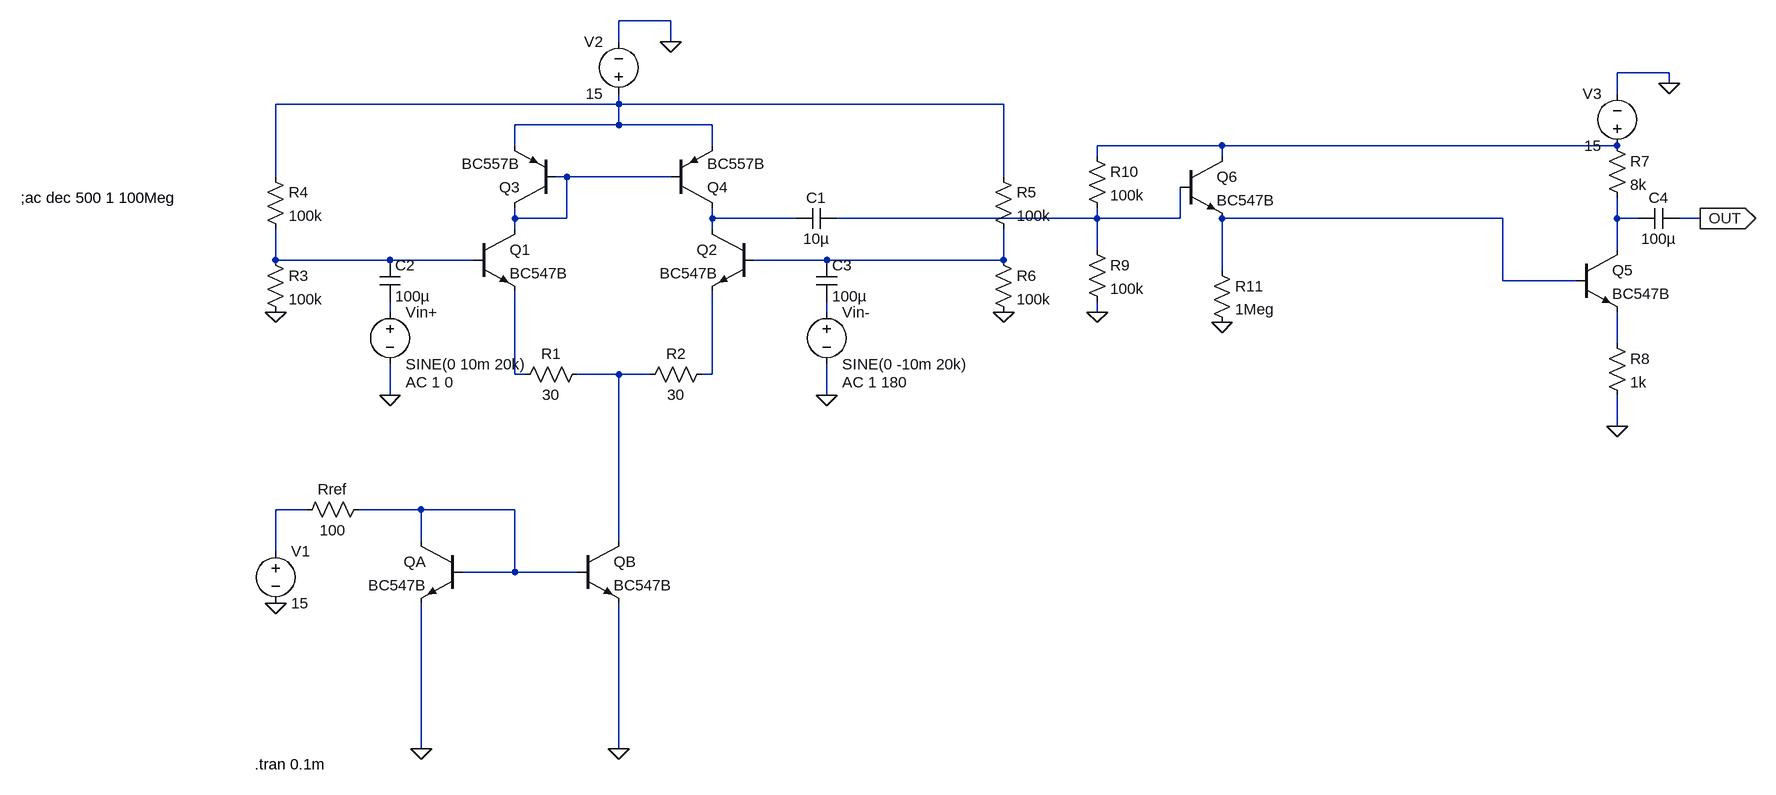
[diagram p0: schematic BJT_Diff_amp_Gain_DE_Buffer.asc]
BJT_Diff_amp_Gain_DE_Buffer.asc, the LTspice schematic file:
Version 4
SHEET 1 2092 1044
WIRE 240 -240 160 -240
WIRE 160 -208 160 -240
WIRE 240 -208 240 -240
WIRE 1776 -160 1696 -160
WIRE 1776 -144 1776 -160
WIRE 1696 -128 1696 -160
WIRE 160 -112 160 -128
WIRE 160 -112 -368 -112
WIRE 752 -112 160 -112
WIRE 160 -80 160 -112
WIRE 160 -80 0 -80
WIRE 304 -80 160 -80
WIRE 0 -48 0 -80
WIRE 304 -48 304 -80
WIRE 1088 -48 896 -48
WIRE 1696 -48 1088 -48
WIRE 896 -32 896 -48
WIRE 1088 -32 1088 -48
WIRE -368 0 -368 -112
WIRE 80 0 64 0
WIRE 240 0 80 0
WIRE 752 0 752 -112
WIRE 0 64 0 48
WIRE 80 64 80 0
WIRE 80 64 0 64
WIRE 304 64 304 48
WIRE 432 64 304 64
WIRE 896 64 896 48
WIRE 896 64 496 64
WIRE 1024 64 1024 16
WIRE 1024 64 896 64
WIRE 1520 64 1088 64
WIRE 1696 64 1696 32
WIRE 1728 64 1696 64
WIRE 1824 64 1792 64
WIRE 0 80 0 64
WIRE 304 80 304 64
WIRE 896 112 896 64
WIRE 1696 112 1696 64
WIRE -368 128 -368 80
WIRE -192 128 -368 128
WIRE -64 128 -192 128
WIRE 480 128 368 128
WIRE 752 128 752 80
WIRE 752 128 480 128
WIRE 1088 144 1088 64
WIRE 1520 160 1520 64
WIRE 1632 160 1520 160
WIRE -192 208 -192 192
WIRE 480 208 480 192
WIRE 896 208 896 192
WIRE 1696 256 1696 208
WIRE 0 304 0 176
WIRE 16 304 0 304
WIRE 160 304 96 304
WIRE 208 304 160 304
WIRE 304 304 304 176
WIRE 304 304 288 304
WIRE -192 336 -192 288
WIRE 480 336 480 288
WIRE 1696 384 1696 336
WIRE -320 512 -368 512
WIRE -144 512 -240 512
WIRE 0 512 -144 512
WIRE -144 560 -144 512
WIRE 160 560 160 304
WIRE -368 576 -368 512
WIRE 0 608 0 512
WIRE 0 608 -80 608
WIRE 96 608 0 608
WIRE -144 880 -144 656
WIRE 160 880 160 656
FLAG -192 336 0
FLAG 480 336 0
FLAG 240 -208 0
FLAG -144 880 0
FLAG 160 880 0
FLAG -368 656 0
FLAG -368 208 0
FLAG 752 208 0
FLAG 1696 384 0
FLAG 1776 -144 0
FLAG 1824 64 OUT
IOPIN 1824 64 Out
FLAG 896 208 0
FLAG 1088 224 0
SYMBOL npn 368 80 M0
SYMATTR InstName Q2
SYMATTR Value BC547B
SYMBOL npn -64 80 R0
SYMATTR InstName Q1
SYMATTR Value BC547B
SYMBOL res 112 288 R90
WINDOW 0 0 56 VBottom 2
WINDOW 3 32 56 VTop 2
SYMATTR InstName R1
SYMATTR Value 30
SYMBOL res 304 288 R90
WINDOW 0 0 56 VBottom 2
WINDOW 3 32 56 VTop 2
SYMATTR InstName R2
SYMATTR Value 30
SYMBOL npn 96 560 R0
SYMATTR InstName QB
SYMATTR Value BC547B
SYMBOL npn -80 560 M0
SYMATTR InstName QA
SYMATTR Value BC547B
SYMBOL res -224 496 R90
WINDOW 0 0 56 VBottom 2
WINDOW 3 32 56 VTop 2
SYMATTR InstName Rref
SYMATTR Value 100
SYMBOL voltage 160 -112 R180
WINDOW 0 24 96 Left 2
WINDOW 3 24 16 Left 2
WINDOW 123 0 0 Left 0
WINDOW 39 0 0 Left 0
SYMATTR InstName V2
SYMATTR Value 15
SYMBOL voltage -192 192 R0
WINDOW 123 24 124 Left 2
WINDOW 39 0 0 Left 0
SYMATTR Value2 AC 1 0
SYMATTR InstName Vin+
SYMATTR Value SINE(0 10m 20k)
SYMBOL voltage 480 192 R0
WINDOW 123 24 124 Left 2
WINDOW 39 0 0 Left 0
SYMATTR Value2 AC 1 180
SYMATTR InstName Vin-
SYMATTR Value SINE(0 -10m 20k)
SYMBOL pnp 64 48 R180
SYMATTR InstName Q3
SYMATTR Value BC557B
SYMBOL pnp 240 48 M180
SYMATTR InstName Q4
SYMATTR Value BC557B
SYMBOL voltage -368 560 R0
WINDOW 123 0 0 Left 0
WINDOW 39 0 0 Left 0
SYMATTR InstName V1
SYMATTR Value 15
SYMBOL cap -208 128 R0
SYMATTR InstName C2
SYMATTR Value 100µ
SYMBOL cap 464 128 R0
SYMATTR InstName C3
SYMATTR Value 100µ
SYMBOL res -384 112 R0
SYMATTR InstName R3
SYMATTR Value 100k
SYMBOL res -384 -16 R0
SYMATTR InstName R4
SYMATTR Value 100k
SYMBOL res 736 -16 R0
SYMATTR InstName R5
SYMATTR Value 100k
SYMBOL res 736 112 R0
SYMATTR InstName R6
SYMATTR Value 100k
SYMBOL npn 1632 112 R0
SYMATTR InstName Q5
SYMATTR Value BC547B
SYMBOL res 1680 -64 R0
SYMATTR InstName R7
SYMATTR Value 8k
SYMBOL res 1680 240 R0
SYMATTR InstName R8
SYMATTR Value 1k
SYMBOL voltage 1696 -32 R180
WINDOW 0 24 96 Left 2
WINDOW 3 24 16 Left 2
WINDOW 123 0 0 Left 0
WINDOW 39 0 0 Left 0
SYMATTR InstName V3
SYMATTR Value 15
SYMBOL cap 1792 48 R90
WINDOW 0 0 32 VBottom 2
WINDOW 3 32 32 VTop 2
SYMATTR InstName C4
SYMATTR Value 100µ
SYMBOL res 880 96 R0
SYMATTR InstName R9
SYMATTR Value 100k
SYMBOL npn 1024 -32 R0
SYMATTR InstName Q6
SYMATTR Value BC547B
SYMBOL res 1072 128 R0
SYMATTR InstName R11
SYMATTR Value 1Meg
SYMBOL cap 496 48 R90
WINDOW 0 0 32 VBottom 2
WINDOW 3 32 32 VTop 2
SYMATTR InstName C1
SYMATTR Value 10µ
SYMBOL res 880 -48 R0
SYMATTR InstName R10
SYMATTR Value 100k
TEXT -400 904 Left 2 !.tran 0.1m
TEXT -760 32 Left 2 !;ac dec 500 1 100Meg

The netlist it stands for:
* BJT_Diff_amp_Gain_DE_Buffer.asc
Q2 N004 N009 N015 0 BC547B
Q1 N003 N008 N013 0 BC547B
R1 N014 N013 30
R2 N015 N014 30
QB N014 N017 0 0 BC547B
QA N017 N017 0 0 BC547B
Rref N017 N016 100
V2 N001 0 15
Vin+ N010 0 SINE(0 10m 20k) AC 1 0
Vin- N011 0 SINE(0 -10m 20k) AC 1 180
Q3 N003 N003 N001 0 BC557B
Q4 N004 N003 N001 0 BC557B
V1 N016 0 15
C2 N008 N010 100µ
C3 N009 N011 100µ
R3 N008 0 100k
R4 N001 N008 100k
R5 N001 N009 100k
R6 N009 0 100k
Q5 N007 N006 N012 0 BC547B
R7 N002 N007 8k
R8 N012 0 1k
V3 N002 0 15
C4 OUT N007 100µ
R9 N005 0 100k
Q6 N002 N005 N006 0 BC547B
R11 N006 0 1Meg
C1 N005 N004 10µ
R10 N002 N005 100k
.model NPN NPN
.model PNP PNP
.lib standard.bjt
.tran 0.1m
;ac dec 500 1 100Meg
.backanno
.end